# Altium schematic sheet LED0805-1_Sch.SchDoc: LED0805-1
size 127 x 101 mm; Author: Hom; CompanyName: KitSprout; DrawnBy: Hom; Engineer: Hom; Organization: KitSprout; Revision: A; SheetNumber: 1; SheetTotal: 1; Version: 1.0; LibVersion: 1.0; PageSetup: Record=PageOptions|CenterHorizontal=True|CenterVertical=True|PrintScale=1.00|XCorrection=1.00|YCorrection=1.00|PrintKind=0|BorderSize=5000000|LeftOffset=0|BottomOffset=0|Orientation=2|PaperLength=1000|PaperWidth=1000|Scale=100|PaperSource=7|PrintQuality=-4|MediaType=1|DitherType=10|PaperKind=A4|PrintScaleMode=0
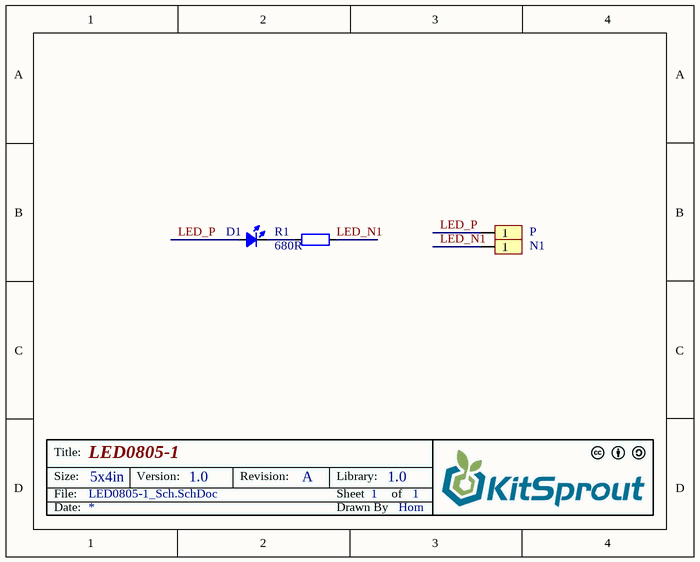
[diagram p0: LED0805-1_Sch.SchDoc]

## Parts
D1  LED_0805  [LED_0805_BLUE]  (value not drawn)
N1  HDR-PAD_2.54  [HDR-PAD_2.54]  (value not drawn)
P  HDR-PAD_2.54  [HDR-PAD_2.54]  (value not drawn)
R1  value 680R  [RES_0805]  (hidden comment: Res_0805)

## Nets
LED_N1: N1.1 R1.2
LED_P: D1.1(A) P.1
NetD1_2: D1.2(K) R1.1

## Notes on the sheet
- Title:
- Size:
- Date:
- File:
- 5x4in
- Version:
- Revision:
- Sheet
- Drawn By
- Library:
- of

## Library data of the parts
D1 = LED_0805: LED
N1 P = HDR-PAD_2.54: Header
R1 = Res_0805: Resistor